# EAGLE schematic bms (EAGLE 4.13)
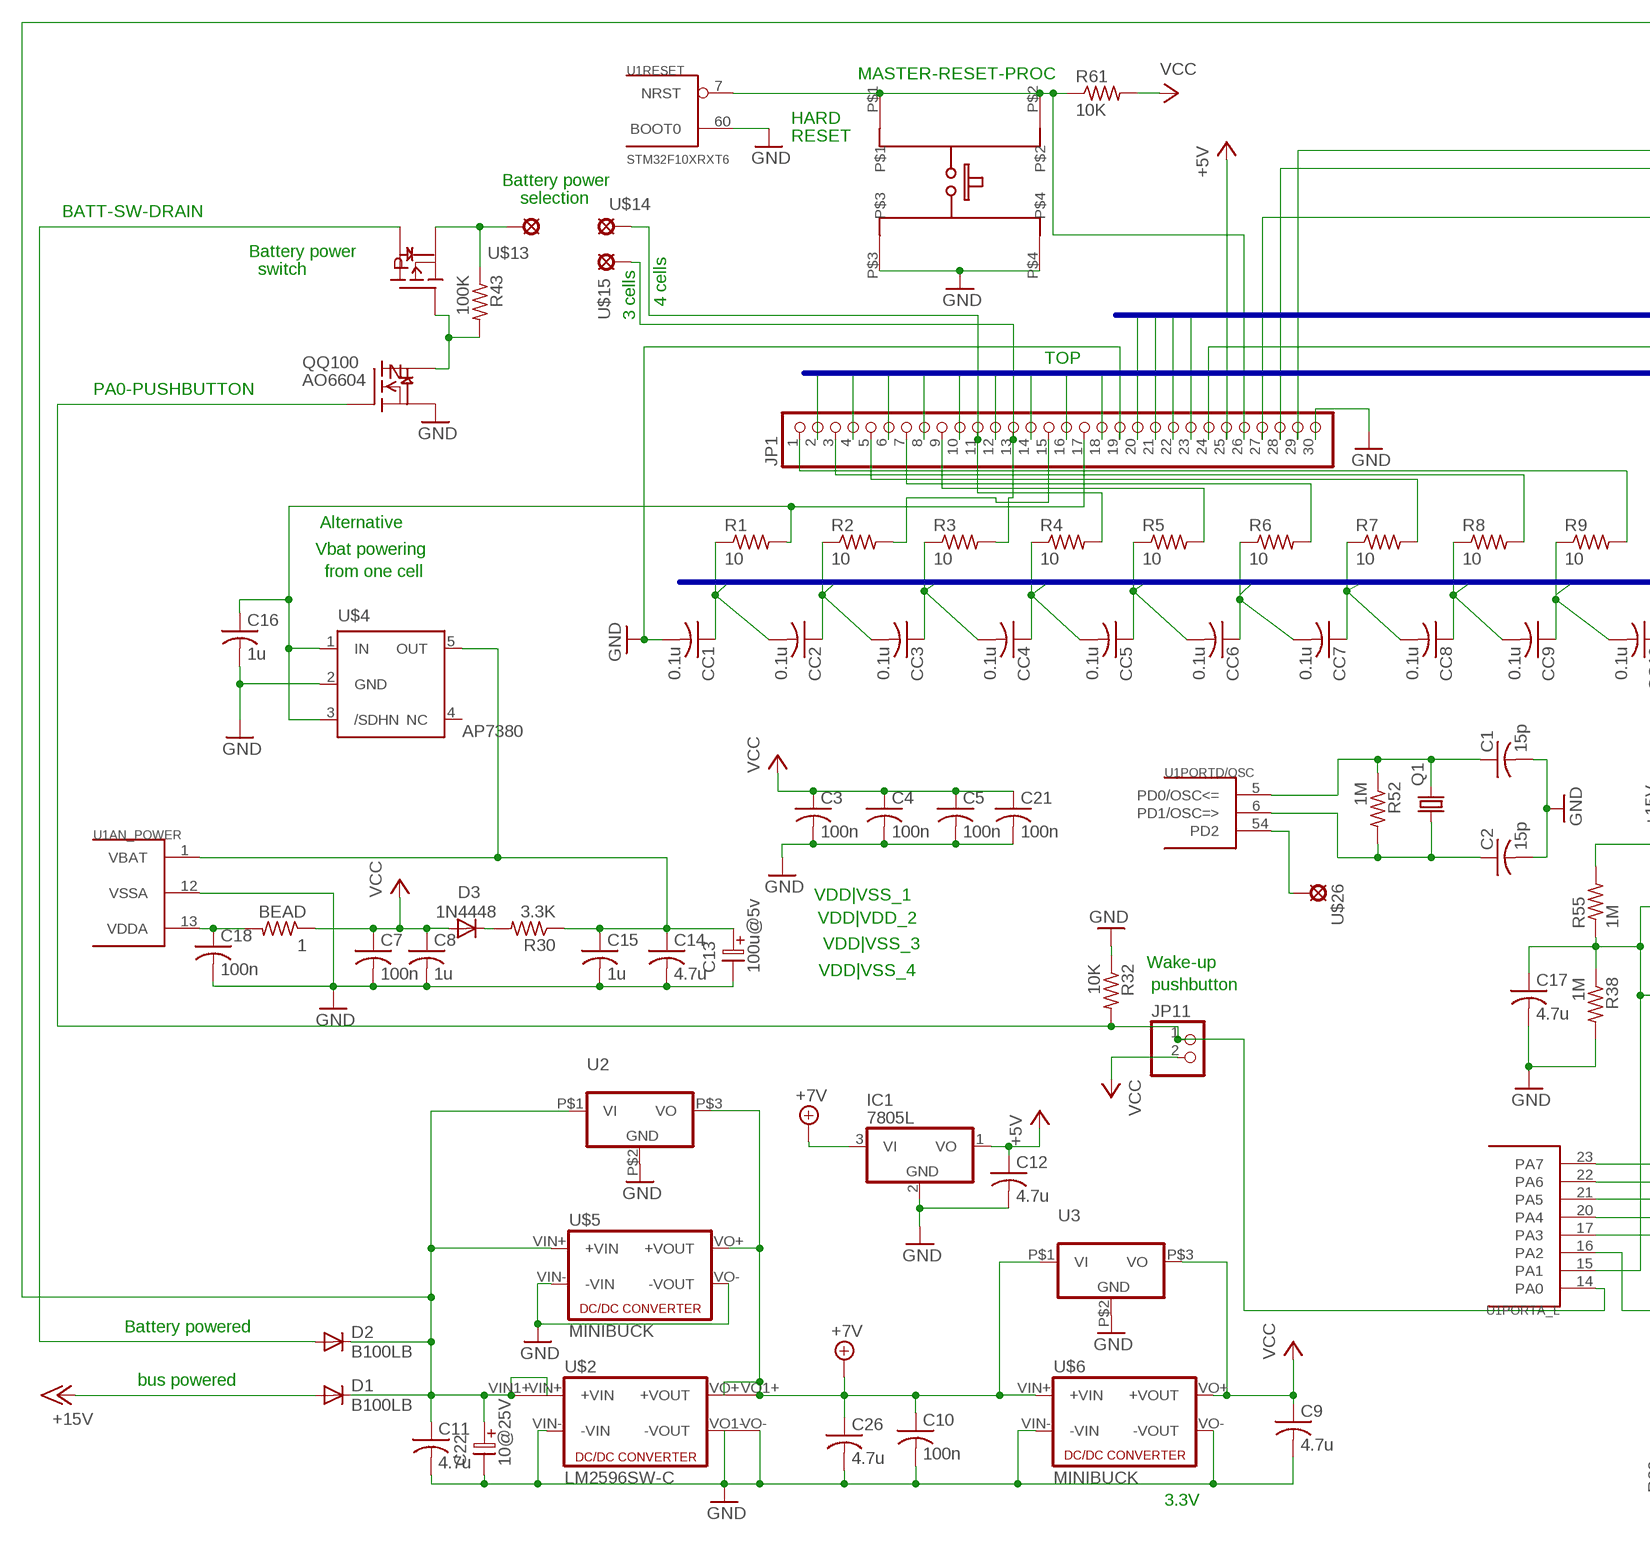
[diagram p0: schematic, sheet 1, part 1 of 2]
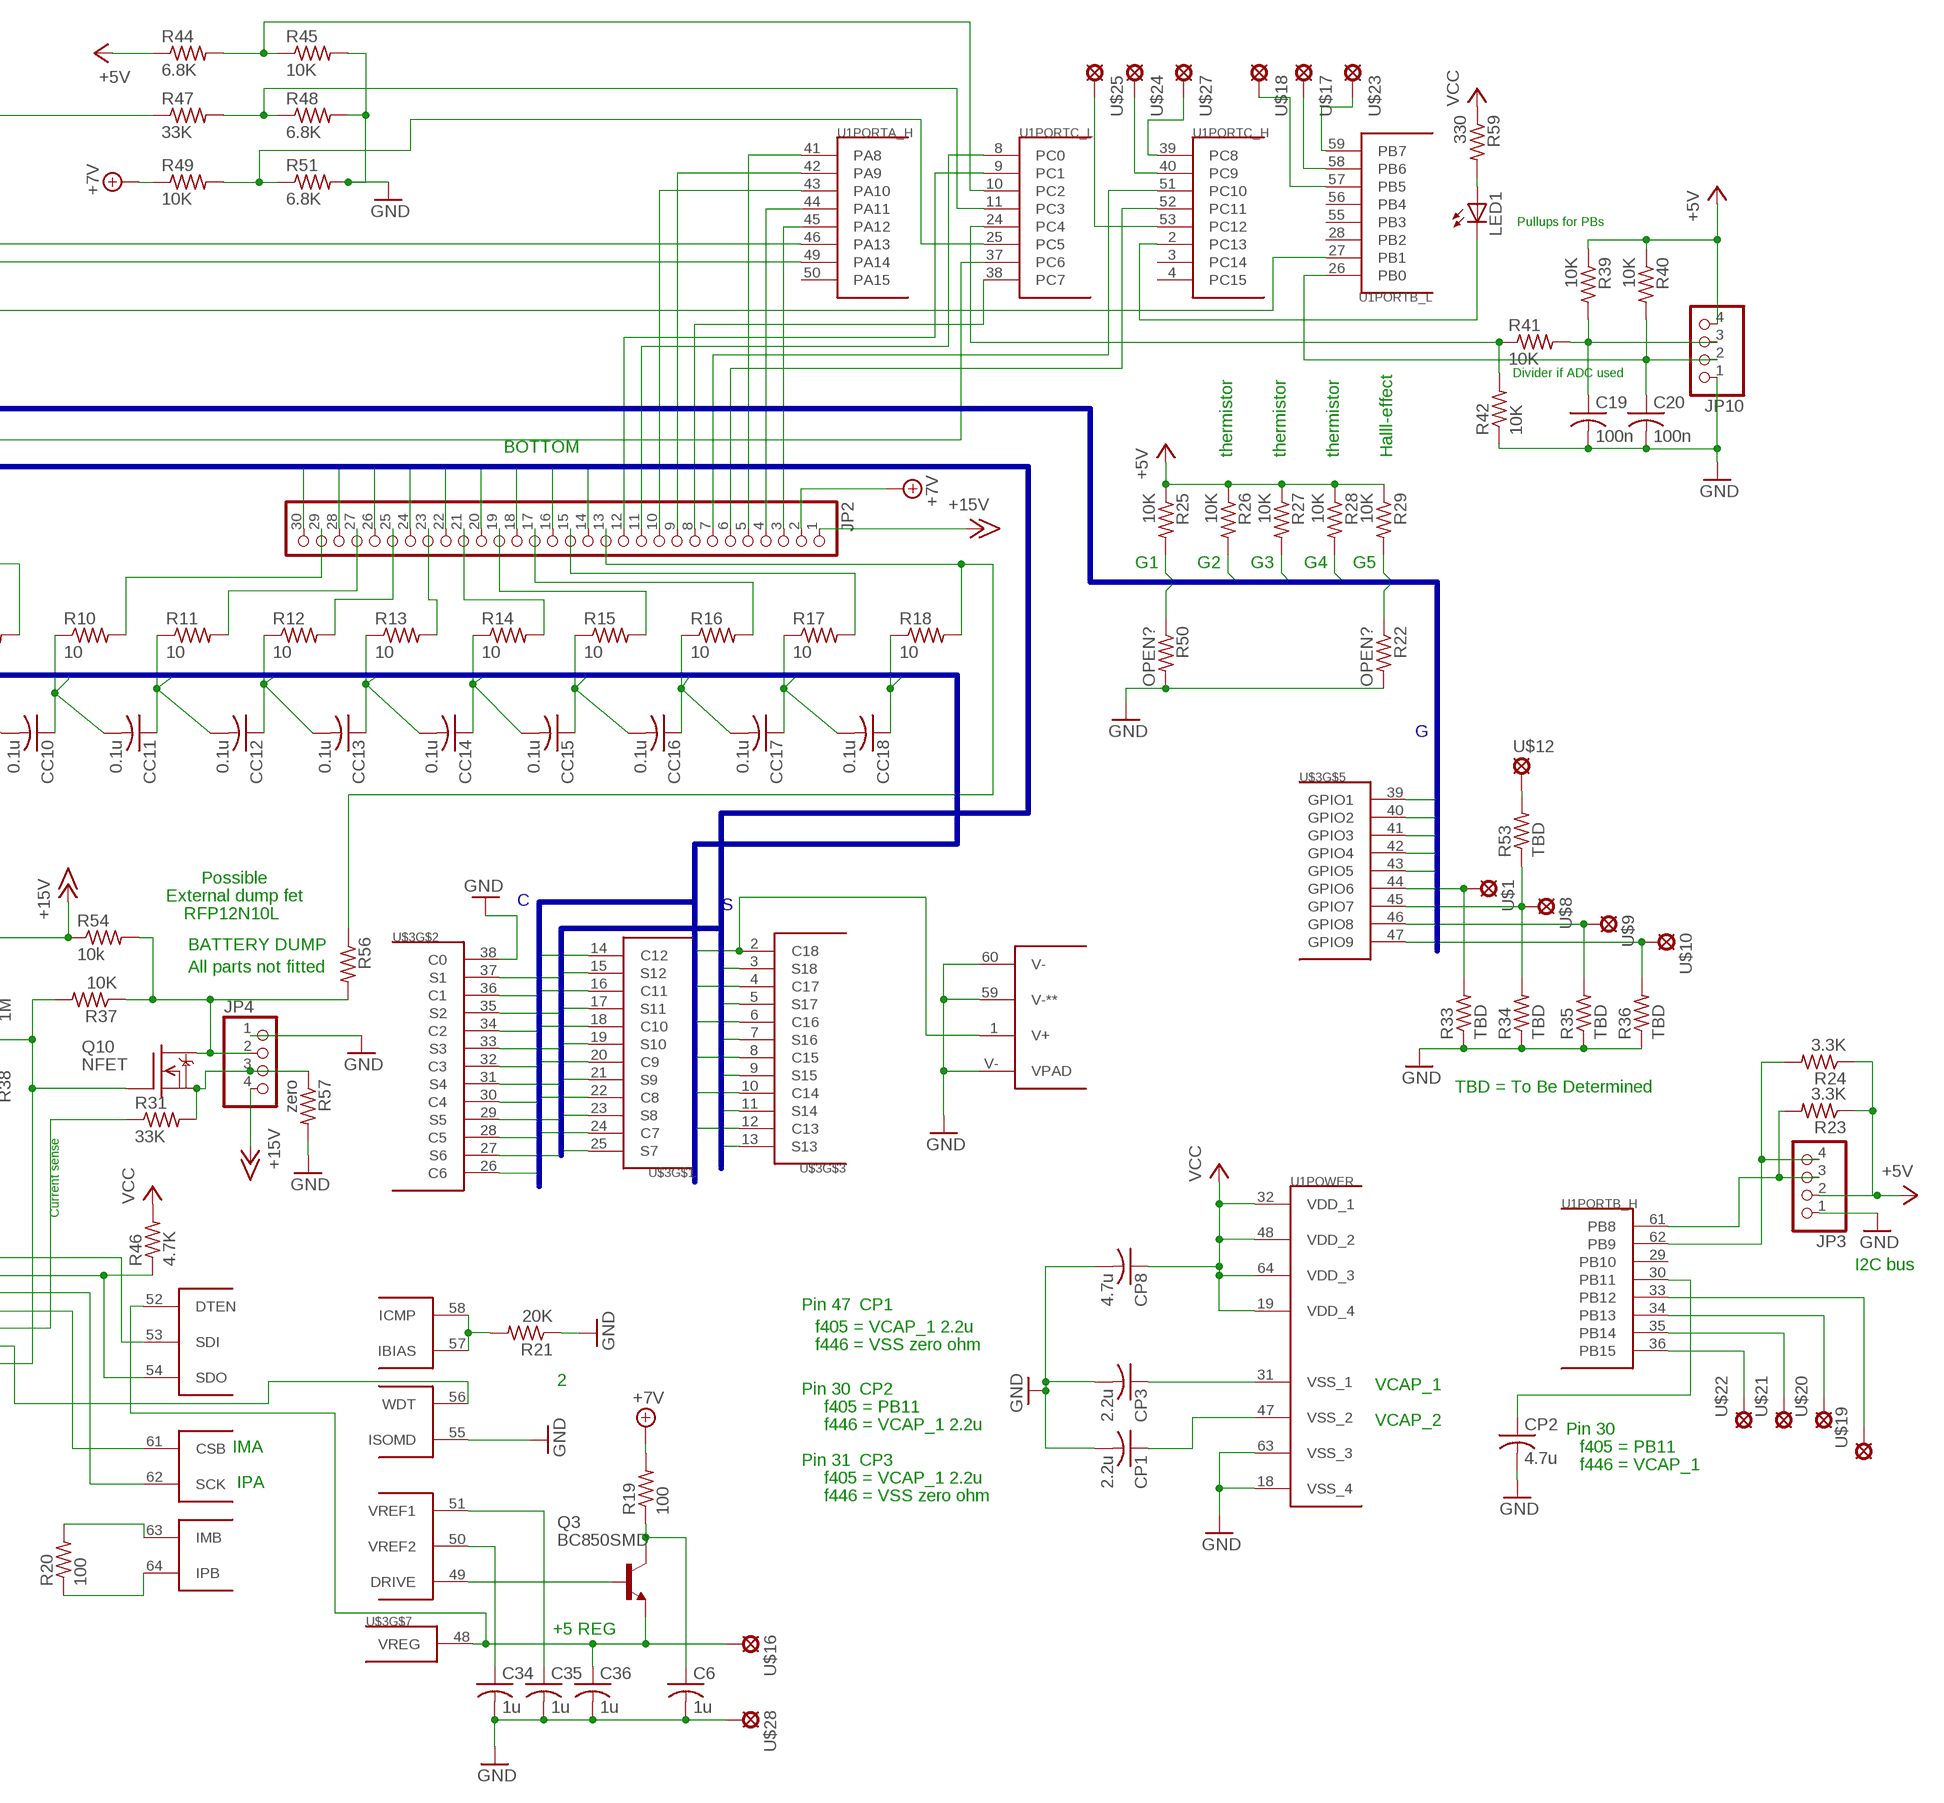
[diagram p1: schematic, sheet 1, part 2 of 2]

## Parts
BEAD  1  R-US_R0603  [R0603]
C1  15p  C-USC0603  [C0603]
C2  15p  C-USC0603  [C0603]
C3  100n  C-USC0603  [C0603]
C4  100n  C-USC0603  [C0603]
C5  100n  C-USC0603  [C0603]
C6  1u  C-USC0603  [C0603]
C7  100n  C-USC0603  [C0603]
C8  1u  C-USC0603  [C0603]
C9  4.7u  C-USC0805  [C0805]
C10  100n  C-USC0603  [C0603]
C11  4.7u  C-USC0603  [C0603]
C12  4.7u  C-USC0805  [C0805]
C13  100u@5v  ELC-2,5L  [ES-2,5L]
C14  4.7u  C-USC0603  [C0603]
C15  1u  C-USC0603  [C0603]
C16  1u  C-USC0603  [C0603]
C17  4.7u  C-USC0603  [C0603]
C18  100n  C-USC0603  [C0603]
C19  100n  C-USC0603  [C0603]
C20  100n  C-USC0603  [C0603]
C21  100n  C-USC0603  [C0603]
C22  10@25V  ELC-2,5L  [ES-2,5L]
C26  4.7u  C-USC0603  [C0603]
C34  1u  C-USC0603  [C0603]
C35  1u  C-USC0603  [C0603]
C36  1u  C-USC0603  [C0603]
CC1  0.1u  C-USC0603  [C0603]
CC2  0.1u  C-USC0603  [C0603]
CC3  0.1u  C-USC0603  [C0603]
CC4  0.1u  C-USC0603  [C0603]
CC5  0.1u  C-USC0603  [C0603]
CC6  0.1u  C-USC0603  [C0603]
CC7  0.1u  C-USC0603  [C0603]
CC8  0.1u  C-USC0603  [C0603]
CC9  0.1u  C-USC0603  [C0603]
CC10  0.1u  C-USC0603  [C0603]
CC11  0.1u  C-USC0603  [C0603]
CC12  0.1u  C-USC0603  [C0603]
CC13  0.1u  C-USC0603  [C0603]
CC14  0.1u  C-USC0603  [C0603]
CC15  0.1u  C-USC0603  [C0603]
CC16  0.1u  C-USC0603  [C0603]
CC17  0.1u  C-USC0603  [C0603]
CC18  0.1u  C-USC0603  [C0603]
CP1  2.2u  C-USC0603  [C0603]
CP2  4.7u  C-USC0603  [C0603]
CP3  2.2u  C-USC0603  [C0603]
CP8  4.7u  C-USC0603  [C0603]
D1  B100LB  [SMB_1]
D2  B100LB  [SMB_1]
D3  1N4448  DIODE-SOD123  [SOD123]
IC1  7805L  [TO92]
JP1  PINHD-1X30  [1X30]
JP2  PINHD-1X30  [1X30]
JP3  PINHD-1X4  [1X04]
JP4  PINHD-1X4  [1X04]
JP10  PINHD-1X4  [1X04]
JP11  PINHD-1X2  [1X02]
LED1  LEDCHIP-LED0603  [CHIP-LED0603]
Q1  CRYTALHC49S  [HC49/S]
Q3  BC850SMD  [SOT23-BEC]
Q10  NFET  DMN3404L  [SOT-23]
QQ100  AO6604  [TSOP6]
R1  10  R-US_R0603  [R0603]
R2  10  R-US_R0603  [R0603]
R3  10  R-US_R0603  [R0603]
R4  10  R-US_R0603  [R0603]
R5  10  R-US_R0603  [R0603]
R6  10  R-US_R0603  [R0603]
R7  10  R-US_R0603  [R0603]
R8  10  R-US_R0603  [R0603]
R9  10  R-US_R0603  [R0603]
R10  10  R-US_R0603  [R0603]
R11  10  R-US_R0603  [R0603]
R12  10  R-US_R0603  [R0603]
R13  10  R-US_R0603  [R0603]
R14  10  R-US_R0603  [R0603]
R15  10  R-US_R0603  [R0603]
R16  10  R-US_R0603  [R0603]
R17  10  R-US_R0603  [R0603]
R18  10  R-US_R0603  [R0603]
R19  100  R-US_R0603  [R0603]
R20  100  R-US_R0603  [R0603]
R21  20K  R-US_R0603  [R0603]
R22  OPEN?  R-US_R0603  [R0603]
R23  3.3K  R-US_R0603  [R0603]
R24  3.3K  R-US_R0603  [R0603]
R25  10K  R-US_R0603  [R0603]
R26  10K  R-US_R0603  [R0603]
R27  10K  R-US_R0603  [R0603]
R28  10K  R-US_R0603  [R0603]
R29  10K  R-US_R0603  [R0603]
R30  3.3K  R-US_R0603  [R0603]
R31  33K  R-US_R0603  [R0603]
R32  10K  R-US_R0603  [R0603]
R33  TBD  R-US_R0603  [R0603]
R34  TBD  R-US_R0603  [R0603]
R35  TBD  R-US_R0603  [R0603]
R36  TBD  R-US_R0603  [R0603]
R37  10K  R-US_R0603  [R0603]
R38  1M  R-US_R0603  [R0603]
R39  10K  R-US_R0603  [R0603]
R40  10K  R-US_R0603  [R0603]
R41  10K  R-US_R0603  [R0603]
R42  10K  R-US_R0603  [R0603]
R43  100K  R-US_R0603  [R0603]
R44  6.8K  R-US_R0603  [R0603]
R45  10K  R-US_R0603  [R0603]
R46  4.7K  R-US_R0603  [R0603]
R47  33K  R-US_R0603  [R0603]
R48  6.8K  R-US_R0603  [R0603]
R49  10K  R-US_R0603  [R0603]
R50  OPEN?  R-US_R0603  [R0603]
R51  6.8K  R-US_R0603  [R0603]
R52  1M  R-US_R0603  [R0603]
R53  TBD  R-US_R0603  [R0603]
R54  10k  R-US_R0603  [R0603]
R55  1M  R-US_R0603  [R0603]
R56  R-US_0411/15  [0411/15]
R57  zero  R-US_R0603  [R0603]
R59  330  R-US_R0603  [R0603]
R61  10K  R-US_R0603  [R0603]
SW1  E-SWITCH  [E-SWITCH]
U1  STM32F10XRXT6  [TQFP64]
U2  78XXTVERT  [TO-220V1]
U3  78XXTVERT  [TO-220V1]
U$1  SOLDPAD028  [SOLPAD028]
U$2  LM2596SW-C  [LM2596SW-C]
U$3  LTC6813  [TQFP64_PAD]
U$4  AP7380  MCP1811  [SOT23-5]
U$5  MINIBUCK  [MINIBUCK]
U$6  MINIBUCK  [MINIBUCK]
U$8  SOLDPAD028  [SOLPAD028]
U$9  SOLDPAD028  [SOLPAD028]
U$10  SOLDPAD028  [SOLPAD028]
U$12  SOLDPAD028  [SOLPAD028]
U$13  SOLDPAD028  [SOLPAD028]
U$14  SOLDPAD028  [SOLPAD028]
U$15  SOLDPAD028  [SOLPAD028]
U$16  SOLDPAD028  [SOLPAD028]
U$17  SOLDPAD028  [SOLPAD028]
U$18  SOLDPAD028  [SOLPAD028]
U$19  SOLDPAD028  [SOLPAD028]
U$20  SOLDPAD028  [SOLPAD028]
U$21  SOLDPAD028  [SOLPAD028]
U$22  SOLDPAD028  [SOLPAD028]
U$23  SOLDPAD028  [SOLPAD028]
U$24  SOLDPAD028  [SOLPAD028]
U$25  SOLDPAD028  [SOLPAD028]
U$26  SOLDPAD028  [SOLPAD028]
U$27  SOLDPAD028  [SOLPAD028]
U$28  SOLDPAD028  [SOLPAD028]

## Nets
7VRC: C6.1 Q3.C R19.1
15V-DIOIDE-ORED: C11.1 C22.1 D1.C D2.C R47.1 U2.P$1(VI) U$2.VIN1+(+VIN1) U$2.VIN+(+VIN) U$5.VIN+(+VIN)
+5V: C12.1 IC1.1(VO) JP1.25 JP3.2 JP10.4 R23.1 R24.1 R25.1 R26.1 R27.1 R28.1 R29.1 R39.1 R40.1 R44.1
+7V: C10.1 C26.1 IC1.3(VI) JP2.2 R19.2 R49.1 U2.P$3(VO) U3.P$1(VI) U$2.VO1+(+VOUT1) U$2.VO+(+VOUT) U$5.VO+(+VOUT) U$6.VIN+(+VIN)
+15V: D1.A JP2.1 JP4.4 R54.1 R55.2
BATT-SELECT: QQ100.P$2(S2) R43.1 U$13.MP
BATT-SW-DRAIN: D2.A QQ100.P$4(D2)
C1: CC1.1 CC2.2 R1.1 U$3.36(C1)
C2: CC2.1 CC3.2 R2.1 U$3.34(C2)
C3: CC3.1 CC4.2 R3.1 U$3.32(C3)
C4: CC4.1 CC5.2 R4.1 U$3.30(C4)
C5: CC5.1 CC6.2 R5.1 U$3.28(C5)
C6: CC6.1 CC7.2 R6.1 U$3.26(C6)
C7: CC7.1 CC8.2 R7.1 U$3.24(C7)
C8: CC8.1 CC9.2 R8.1 U$3.22(C8)
C9: CC9.1 CC10.2 R9.1 U$3.20(C9)
C10: CC10.1 CC11.2 R10.1 U$3.18(C10)
C11: CC11.1 CC12.2 R11.1 U$3.16(C11)
C12: CC12.1 CC13.2 R12.1 U$3.14(C12)
C13: CC13.1 CC14.2 R13.1 U$3.12(C13)
C14: CC14.1 CC15.2 R14.1 U$3.10(C14)
C15: CC15.1 CC16.2 R15.1 U$3.8(C15)
C16: CC16.1 CC17.2 R16.1 U$3.6(C16)
C17: CC17.1 CC18.2 R17.1 U$3.4(C17)
C18: CC18.1 R18.1 U$3.1(V+) U$3.2(C18)
CF10: JP2.29 R10.2
CF11: JP2.27 R11.2
CF12: JP2.25 R12.2
CF13: JP2.23 R13.2
CF14: JP2.21 R14.2
CF15: JP2.19 R15.2
CF16: JP2.17 R16.2
CF17: JP2.15 R17.2
CF18: JP2.13 R18.2 R56.1
CL1: C16.1 JP1.17 R1.2 U$4.1(IN) U$4.3(/SDHN)
CL2: JP1.15 R2.2
CL3: JP1.13 R3.2 U$15.MP
CL4: JP1.11 R4.2 U$14.MP
CL5: JP1.9 R5.2
CL6: JP1.7 R6.2
CL7: JP1.5 R7.2
CL8: JP1.3 R8.2
CL9: JP1.1 R9.2
DRIVE: Q3.B U$3.49(DRIVE)
DUAL-FET-BATT-SWITCH: QQ100.P$3(G2) QQ100.P$6(D1) R43.2
DUMPFETSOURCE: JP4.3 Q10.2(S) R31.2 R57.1
G1: R25.2 R50.1 U$3.39(GPIO1)
G2: JP1.23 R26.2 U$3.40(GPIO2)
G3: JP1.22 R27.2 U$3.41(GPIO3)
G4: JP1.21 R28.2 U$3.42(GPIO4)
G5: JP1.20 R22.1 R29.2 U$3.43(GPIO5)
G6: R33.2 U$1.MP U$3.44(GPIO6)
G7: R34.2 R53.1 U$3.45(GPIO7) U$8.MP
G7-DIVIDER-HIGH: R53.2 U$12.MP
G8: R35.2 U$3.46(GPIO8) U$9.MP
G9: R36.2 U$3.47(GPIO9) U$10.MP
GND: C1.2 C2.2 C3.2 C4.2 C5.2 C6.2 C7.2 C8.2 C9.2 C10.2 C11.2 C12.2 C13.2 C14.2 C15.2 C16.2 C17.2 C18.2 C19.2 C20.2 C21.2 C22.2 C26.2 C34.2 C35.2 C36.2 CC1.2 CP1.2 CP2.2 CP3.2 CP8.2 IC1.2(GND) JP1.19 JP1.30 JP3.1 JP4.1 JP10.1 QQ100.P$5(S1) R21.1 R22.2 R32.1 R33.1 R34.1 R35.1 R36.1 R38.2 R42.1 R45.2 R48.2 R50.2 R51.2 R57.2 SW1.P$3 SW1.P$4 U1.12(AN_POWER:VSSA) U1.18(POWER:VSS_4) U1.60(RESET:BOOT0) U1.63(POWER:VSS_3) U2.P$2(GND) U3.P$2(GND) U$2.VIN-(-VIN) U$2.VO1-(-VOUT) U$2.VO-(-VOUT1) U$3.38(C0) U$3.55(ISOMD) U$3.59(V-**) U$3.60(V-) U$3.V-(VPAD) U$4.2(GND) U$5.VIN-(-VIN) U$5.VO-(-VOUT) U$6.VIN-(-VIN) U$6.VO-(-VOUT) U$28.MP
ICMP-IBIAS: R21.2 U$3.57(IBIAS) U$3.58(ICMP)
IMB: R20.2 U$3.63(IMB)
IPB: R20.1 U$3.64(IPB)
JP12-FETDRAIN-RC: JP4.2 Q10.3(D) R37.1 R54.2 R56.2
JTCK: JP1.28 U1.49(PORTA_H:PA14)
JTMS: JP1.29 U1.46(PORTA_H:PA13)
LED1-A: LED1.A R59.2
N$1: JP1.24 U1.37(PORTC_L:PC6)
NRST: JP1.26 R61.1 SW1.P$1 SW1.P$2 U1.7(RESET:NRST)
PA0-PUSHBUTTON: JP11.1 QQ100.P$1(G1) R32.2 U1.14(PORTA_L:PA0)
PA1-DUMPFETGATE: C17.1 Q10.1(G) R37.2 R38.1 R55.1 U1.15(PORTA_L:PA1)
PA2|WDT: U1.16(PORTA_L:PA2) U$3.56(WDT)
PA3-DUMP-CURRENT: R31.1 U1.17(PORTA_L:PA3)
PA4-SP1_NSS-CSB: U1.20(PORTA_L:PA4) U$3.61(CSB)
PA5-SPI1_SCK-CLK: U1.21(PORTA_L:PA5) U$3.62(SCK)
PA6-SP1_MISO-SDO: R46.1 U1.22(PORTA_L:PA6) U$3.54(SDO)
PA7-SPI1_MOSI-SDI: U1.23(PORTA_L:PA7) U$3.53(SDI)
PA8-T1CH1-FANGATE: JP2.5 U1.41(PORTA_H:PA8)
PA9-USART1-TX: JP2.9 U1.42(PORTA_H:PA9)
PA10-USART1-RX: JP2.10 U1.43(PORTA_H:PA10)
PA11_CANRXD: JP2.4 U1.44(PORTA_H:PA11)
PA12_CANTX: JP2.3 U1.45(PORTA_H:PA12)
PB0: C20.1 JP10.2 R40.2 U1.26(PORTB_L:PB0)
PB1-T3C4-FANTACH: JP1.27 U1.27(PORTB_L:PB1)
PB5-CAN2-RX: U1.57(PORTB_L:PB5) U$18.MP
PB6-CAN2-TX: U1.58(PORTB_L:PB6) U$17.MP
PB7: U1.59(PORTB_L:PB7) U$23.MP
PB8-I2C2-SDA: JP3.3 R23.2 U1.61(PORTB_H:PB8)
PB9-I2C1-SCL: JP3.4 R24.2 U1.62(PORTB_H:PB9)
PB11-I2C2-SDA|VCAP1: CP2.1 U1.30(PORTB_H:PB11)
PB12-SPI2-NSS: U1.33(PORTB_H:PB12) U$19.MP
PB14-SPI2-MISO: U1.35(PORTB_H:PB14) U$21.MP
PB-13-SPI2-SCK: U1.34(PORTB_H:PB13) U$20.MP
PB-15-SPI2-MOSI: U1.36(PORTB_H:PB15) U$22.MP
PC0-15VDIVIDED-IN10: JP2.11 U1.8(PORTC_L:PC0)
PC1-BATDIVIDED-IN11: JP2.12 U1.9(PORTC_L:PC1)
PC2-IN12-5V-DIVIDED: R44.2 R45.1 U1.10(PORTC_L:PC2)
PC3-15V-OR-DIVIDED-IN13: R47.2 R48.1 U1.11(PORTC_L:PC3)
PC4-HEADER: C19.1 JP10.3 R39.2 R41.2
PC4-IN14: R41.1 R42.2 U1.24(PORTC_L:PC4)
PC5-7VDIVIDED-IN15: R49.2 R51.1 U1.25(PORTC_L:PC5)
PC7-T3C2-MCP1416-INPUT: JP2.8 U1.38(PORTC_L:PC7)
PC8-SDIO_D0: U1.39(PORTC_H:PC8) U$27.MP
PC9-SDIO_D1: U1.40(PORTC_H:PC9) U$24.MP
PC10-LED2: JP2.7 U1.51(PORTC_H:PC10)
PC11-LED1: JP2.6 U1.52(PORTC_H:PC11)
PC12-SDIO_CK|I2C2-SDA: U1.53(PORTC_H:PC12) U$25.MP
PC13-LED1: LED1.C U1.2(PORTC_H:PC13)
PD0_OSC_IN_XTAL: C1.1 Q1.2 R52.1 U1.5(PORTD/OSC:PD0/OSC<=)
PD1_OSC_OUT: C2.1 Q1.1 R52.2 U1.6(PORTD/OSC:PD1/OSC=>)
PD2-SDIO_CMD: U1.54(PORTD/OSC:PD2) U$26.MP
S1: JP1.18 U$3.37(S1)
S2: JP1.16 U$3.35(S2)
S3: JP1.14 U$3.33(S3)
S4: JP1.12 U$3.31(S4)
S5: JP1.10 U$3.29(S5)
S6: JP1.8 U$3.27(S6)
S7: JP1.6 U$3.25(S7)
S8: JP1.4 U$3.23(S8)
S9: JP1.2 U$3.21(S9)
S10: JP2.30 U$3.19(S10)
S11: JP2.28 U$3.17(S11)
S12: JP2.26 U$3.15(S12)
S13: JP2.24 U$3.13(S13)
S14: JP2.22 U$3.11(S14)
S15: JP2.20 U$3.9(S15)
S16: JP2.18 U$3.7(S16)
S17: JP2.16 U$3.5(S17)
S18: JP2.14 U$3.3(S18)
VBAT: C13.1 C14.1 C15.1 R30.1 U1.1(AN_POWER:VBAT) U$4.5(OUT)
VBAT-DIODE-RES: D3.C R30.2
VCC: BEAD.1 C3.1 C4.1 C5.1 C7.1 C8.1 C9.1 C21.1 CP8.1 D3.A JP11.2 R46.2 R59.1 R61.2 U1.19(POWER:VDD_4) U1.32(POWER:VDD_1) U1.48(POWER:VDD_2) U1.64(POWER:VDD_3) U3.P$3(VO) U$6.VO+(+VOUT)
VDDA: BEAD.2 C18.1 U1.13(AN_POWER:VDDA)
VREF1: C35.1 U$3.51(VREF1)
VREF2: C34.1 U$3.50(VREF2)
VREG: C36.1 Q3.E U$3.48(VREG) U$3.52(DTEN) U$16.MP
VSS_1-VCAP_1: CP3.1 U1.31(POWER:VSS_1)
VSS_2: CP1.1 U1.47(POWER:VSS_2)
Unconnected: U1.3(PORTC_H:PC14) U1.4(PORTC_H:PC15) U1.28(PORTB_L:PB2) U1.29(PORTB_H:PB10) U1.50(PORTA_H:PA15) U1.55(PORTB_L:PB3) U1.56(PORTB_L:PB4) U$4.4(NC)

## Buses
G[1..9]
C[0..18]
S[1..18]

## Notes on the sheet
- MASTER-RESET-PROC
- HARD
- Pullups for PBs
- RESET
- Battery power
- selection
- BATT-SW-DRAIN
- Battery power
- switch
- Divider if ADC used
- 4 cells
- 3 cells
- TOP | BOTTOM | thermistor | thermistor | thermistor | Halll-effect
- PA0-PUSHBUTTON
- G1 | G2 | G3 | G4 | G5
- Alternative
- Vbat powering
- from one cell
- G
- Possible
- External dump fet | C
- S
- RFP12N10L
- BATTERY DUMP
- All parts not fitted
- VDD|VSS_1
- VDD|VDD_2
- VDD|VSS_3
- VDD|VSS_4 | Wake-up
- pushbutton
- TBD = To Be Determined
- Current sense
- I2C bus
- Pin 47 | CP1
- f405 = VCAP_1 2.2u
- f446 = VSS zero ohm
- 2 | VCAP_1
- Pin 30 | CP2
- f405 = PB11
- Battery powered | f446 = VCAP_1 2.2u | VCAP_2
- Pin 30
- IMA | f405 = PB11
- Pin 31 | CP3 | f446 = VCAP_1
- bus powered | f405 = VCAP_1 2.2u
- IPA
- f446 = VSS zero ohm
- 3.3V
- +5 REG

## Library data of the parts
BEAD R1-R57 R59 R61 = rcl:R-US_: RESISTOR, American symbol
C1-C12 C14-C21 C26 C34-C36 CC1-CC18 CP1-CP3 CP8 = rcl:C-US: CAPACITOR, American symbol
C13 C22 = DEH:ELC-2,5L
D1 D2 = diode-1:B100LB
D3 = diode:DIODE-: DIODE
IC1 = linear:78*: Positive VOLTAGE REGULATOR
JP1 JP2 = pinhead:PINHD-1X30: PIN HEADER
JP3 JP4 JP10 = pinhead:PINHD-1X4: PIN HEADER
JP11 = pinhead:PINHD-1X2: PIN HEADER
LED1 = led:LED: LED OSRAM: - CHIPLED LG R971, LG N971, LY N971, LG Q971, LY Q971, LO R971, LY R971 LH N974, LH R974 LS Q976, LO Q976, LY Q976 LO Q996 - Hyper CHIPLED LW Q18S LB Q993, LB Q99A, LB R99A - SideLED LS A670, LO A670, LY A670, LG A670, LP A670 LB A673, LV A673, LT A673, LW A673 LH A674 LY A675 LS A676, LA A676, LO A676, LY A676, LW A676 LS A679, LY A679, LG A679 - Hyper Micro SIDELED® LS Y876, LA Y876, LO Y876, LY Y876 LT Y87S - SmartLED LW L88C, LW L88S LB L89C, LB L89S, LG L890 LS L89K, LO L89K, LY L89K LS L896, LA L896, LO L896, LY L896 - TOPLED LS T670, LO T670, LY T670, LG T670, LP T670 LSG T670, LSP T670, LSY T670, LOP T670, LYG T670 LG T671, LOG T671, LSG T671 LB T673, LV T673, LT T673, LW T673 LH T674 LS T676, LA T676, LO T676, LY T676, LB T676, LH T676, LSB T676, LW T676 LB T67C, LV T67C, LT T67C, LS T67K, LO T67K, LY T67K, LW E67C LS E67B, LA E67B, LO E67B, LY E67B, LB E67C, LV E67C, LT E67C LW T67C LS T679, LY T679, LG T679 LS T770, LO T770, LY T770, LG T770, LP T770 LB T773, LV T773, LT T773, LW T773 LH T774 LS E675, LA E675, LY E675, LS T675 LS T776, LA T776, LO T776, LY T776, LB T776 LHGB T686 LT T68C, LB T68C - Hyper Mini TOPLED® LB M676 - Mini TOPLED Santana® LG M470 LS M47K, LO M47K, LY M47K Source: http://www.osram.convergy.de/
Q1 = crystal:CRYTAL: CRYSTAL
Q3 = transistor-npn:BC850*: NPN Transistor
Q10 = transistor-fet:DMN3404L
QQ100 = transistor-fet:AO6604
SW1 = switch-misc:E-SWITCH
U1 = stm32:STM32F10XRXT6: STM32F101/103 64pin LQFP
U2 U3 = DEH:78XXTVERT
U$1 U$8-U$10 U$12-U$28 = solpad:SOLDPAD028
U$2 = dc-dc-converter:LM2596SW-C
U$3 = stm32:LTC6813
U$4 = v-reg-2:MCP1811
U$5 U$6 = dc-dc-converter:MINIBUCK